# EAGLE design untitled (EAGLE 9.6.2)
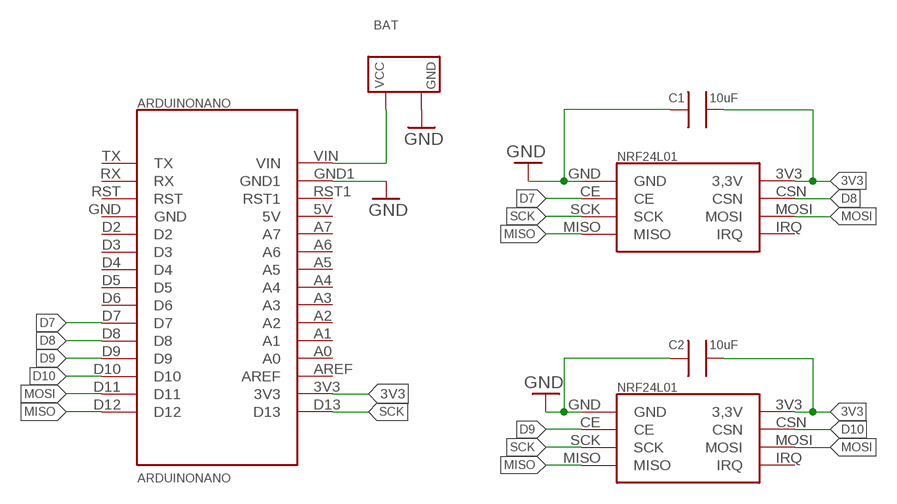
[diagram p0: schematic, sheet 1]

## Parts
ARDUINONANO  ARDUINONANO  [ARDUINONANO]
BAT1  BATBAT  [BAT]
C1  NRF24L01  [NRF24L01]
C2  NRF24L01  [NRF24L01]
U$3  C  [C]
U$4  C  [C]

## Nets
3V3: ARDUINONANO.3V3 C1.3V3(3,3V) C2.3V3(3,3V) U$3.+ U$4.+
D7: ARDUINONANO.D7 C2.CE
D8: ARDUINONANO.D8 C2.CSN
D9: ARDUINONANO.D9 C1.CE
D10: ARDUINONANO.D10 C1.CSN
GND: ARDUINONANO.GND1 BAT1.GND C1.GND C2.GND U$3.- U$4.-
MISO: ARDUINONANO.D12 C1.MISO C2.MISO
MOSI: ARDUINONANO.D11 C1.MOSI C2.MOSI
N$4: ARDUINONANO.VIN BAT1.VCC
SCK: ARDUINONANO.D13 C1.SCK C2.SCK
Unconnected: ARDUINONANO.5V ARDUINONANO.A0 ARDUINONANO.A1 ARDUINONANO.A2 ARDUINONANO.A3 ARDUINONANO.A4 ARDUINONANO.A5 ARDUINONANO.A6 ARDUINONANO.A7 ARDUINONANO.AREF ARDUINONANO.D2 ARDUINONANO.D3 ARDUINONANO.D4 ARDUINONANO.D5 ARDUINONANO.D6 ARDUINONANO.GND ARDUINONANO.RST ARDUINONANO.RST1 ARDUINONANO.RX ARDUINONANO.TX C1.IRQ C2.IRQ

## Notes on the sheet
- BAT
- C1 | 10uF
- C2 | 10uF

## Library data of the parts
ARDUINONANO = lib prueba cnc:ARDUINONANO
BAT1 = Libreria banana leaf_V2:BAT
C1 C2 = Libreria banana leaf_V2:NRF24L01
U$3 U$4 = lib prueba cnc:C

## Board
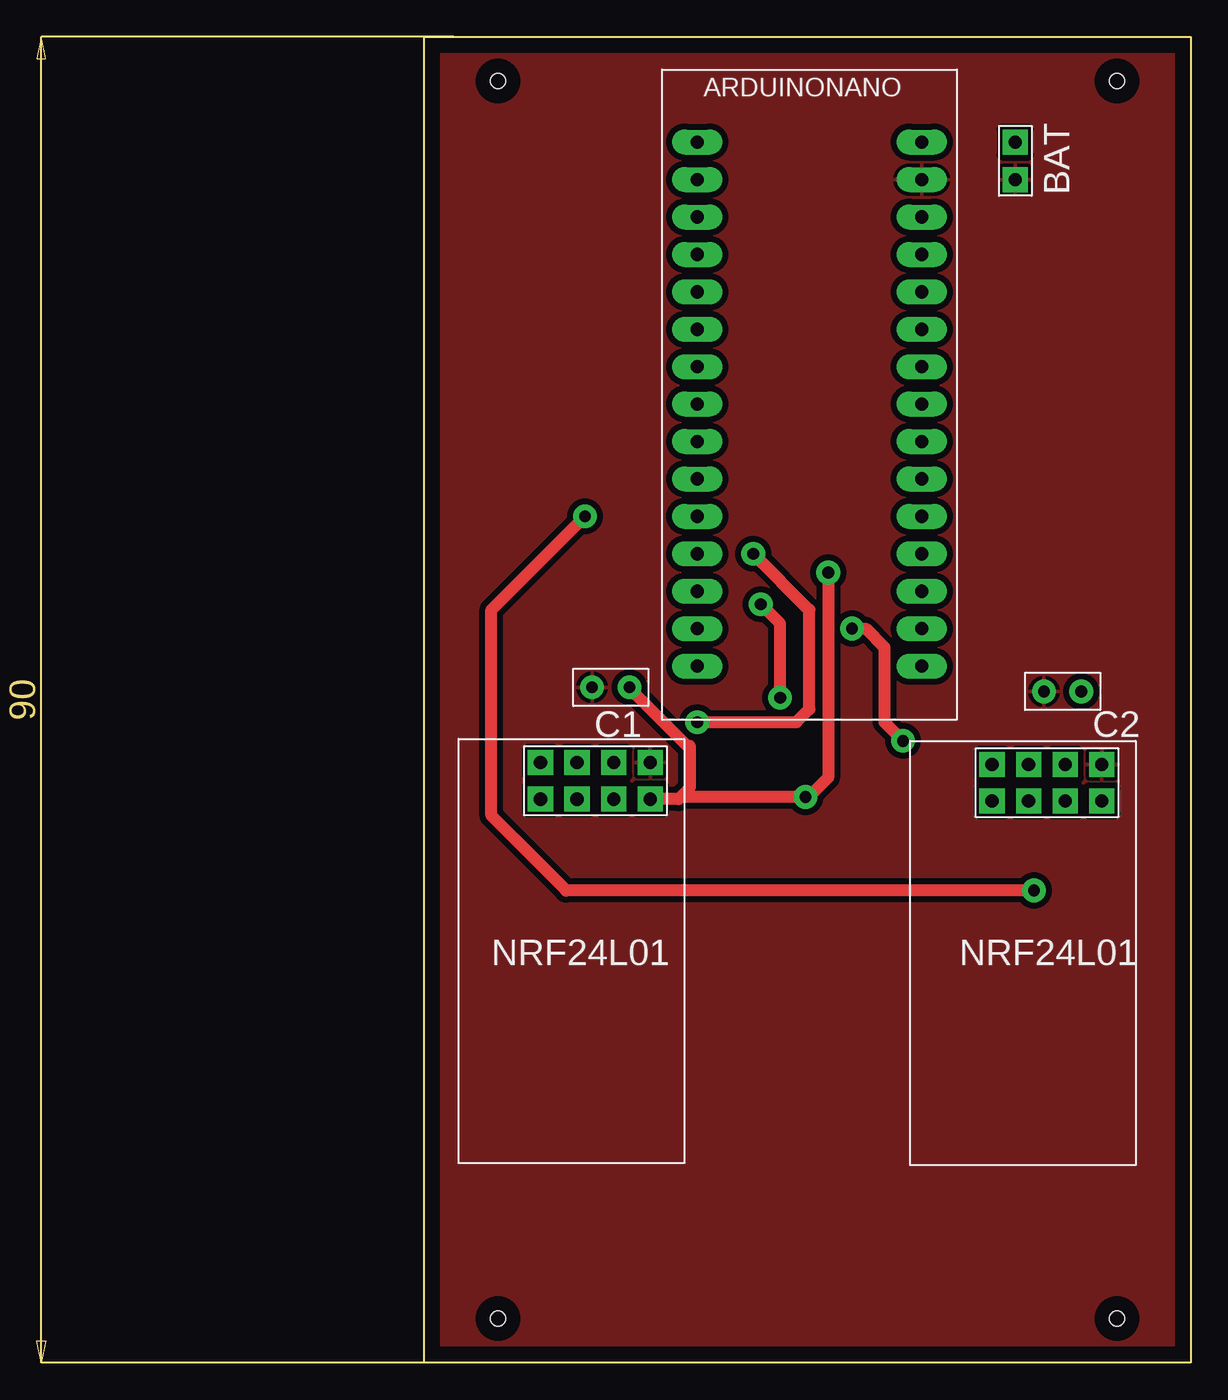
[diagram p1: board, top side]
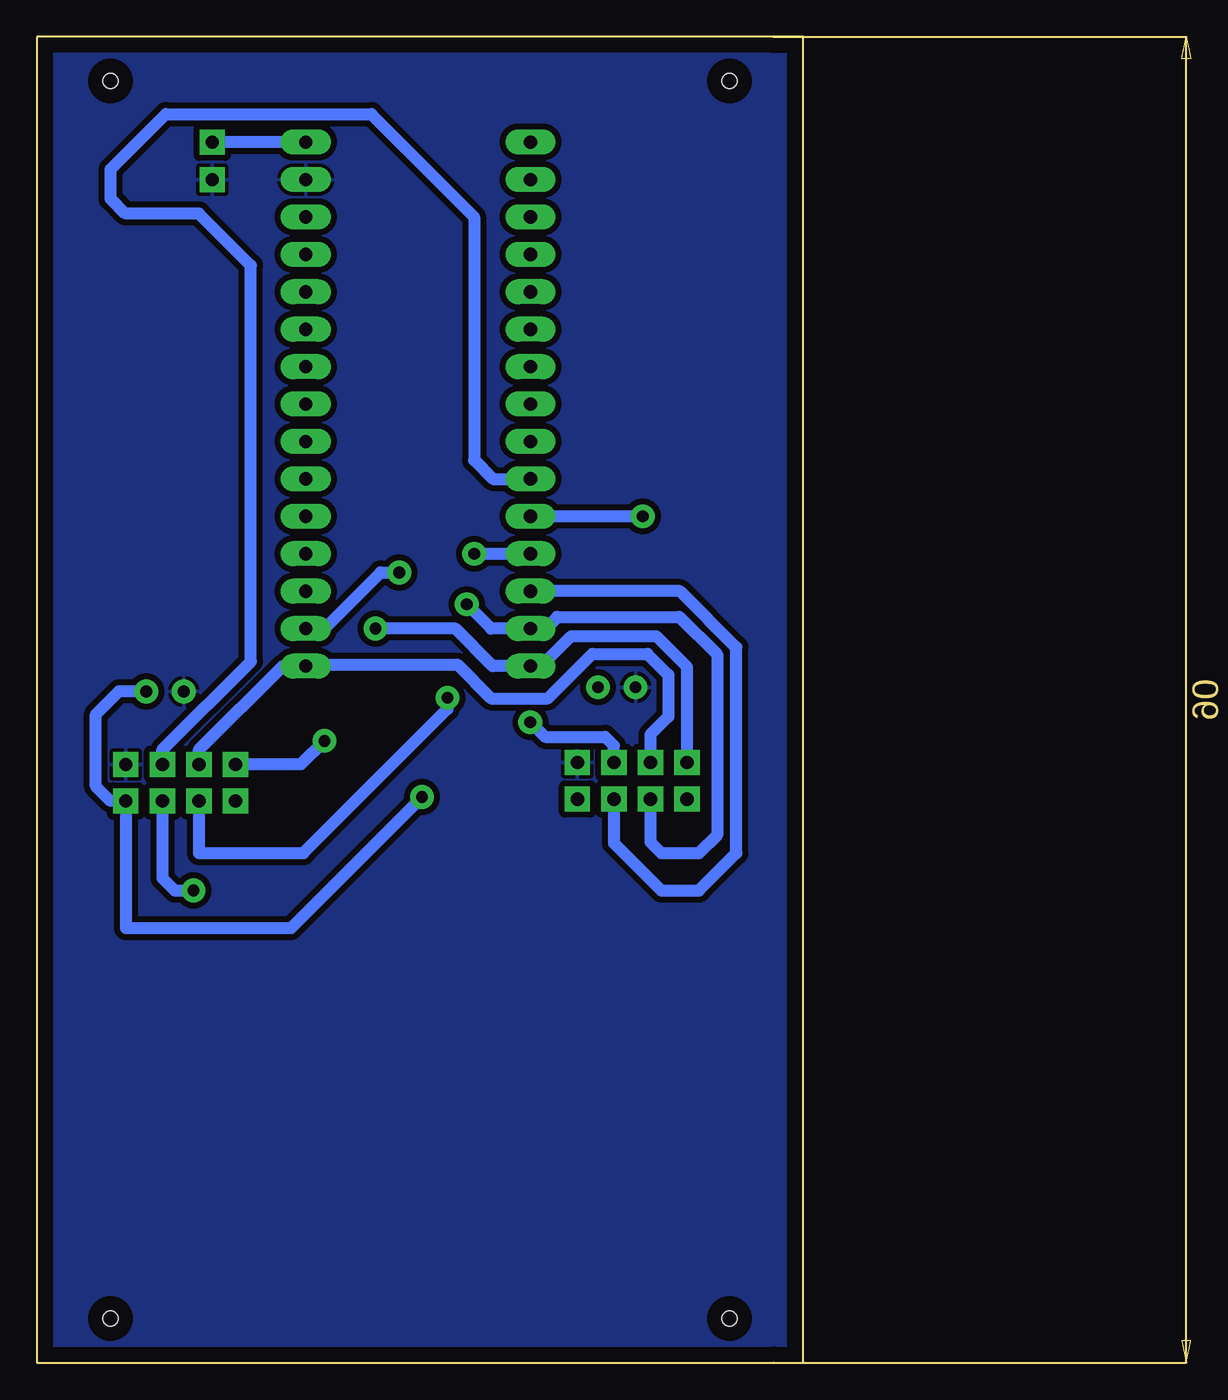
[diagram p2: board, bottom side, seen from below]

Size 52 x 90 mm. Coordinates in mm from the lower left corner, seen from the top.
Outline: 0,0 0,90 52,90 52,0 0,0
Copper layers (1*16): Top 0.035mm / dielectric 1.5mm / Bottom 0.035mm
Design rules "default *": minimum track width 0.8mm, minimum drill 0.8mm, track to track 16mil, track to pad 16mil, pad to pad 16mil, via to via 16mil, smd to smd 16mil, copper to edge 40mil, drill to drill 6mil, minimum pad ring 16mil, minimum via ring 16mil, stop-mask expansion 4mil, vias tented up to drill 0mil, thermal gap 10mil
Holes 1 mm at 5,87 47,87 5,3 47,3

### Footprints (pad centres in the part's own frame; a part is rotated, then mirrored left to right if it is on the bottom)
ARDUINONANO = drill 0.9 pad 1.27 long: 3V3 7.62,-15.24; 5V 7.62,10.16; A0 7.62,-10.16; A1 7.62,-7.62; A2 7.62,-5.08; A3 7.62,-2.54; A4 7.62,0; A5 7.62,2.54; A6 7.62,5.08; A7 7.62,7.62; AREF 7.62,-12.7; D2 -7.62,7.62; D3 -7.62,5.08; D4 -7.62,2.54; D5 -7.62,0; D6 -7.62,-2.54; D7 -7.62,-5.08; D8 -7.62,-7.62; D9 -7.62,-10.16; D10 -7.62,-12.7; D11 -7.62,-15.24; D12 -7.62,-17.78; D13 7.62,-17.78; GND -7.62,10.16; GND1 7.62,15.24; RST -7.62,12.7; RST1 7.62,12.7; RX -7.62,15.24; TX -7.62,17.78; VIN 7.62,17.78
BAT = drill 0.9 square: GND 0,-1.27; VCC 0,1.27
NRF24L01 = drill 0.9 square: 3V3 4.08,-2.3; CE 1.6,-4.78; CSN 4.08,-4.78; GND 1.6,-2.3; IRQ 4.08,-9.74; MISO 1.6,-9.74; MOSI 4.08,-7.26; SCK 1.6,-7.26
C = drill 0.8: + 0,0; - -2.54,0

### Placement (x,y rotation side)
ARDUINONANO  26.13,65.07 0 top
BAT1  40.1,81.58 0 top
C1  17.62,42.34 270 top
C2  48.26,42.21 270 top
U$3  13.91,45.84 0 top
U$4  44.58,45.56 0 top

### Tracks (layer width: path | path; a pad name or v marks a point on that pad's centre or on a via)
3V3  (via drill 0.8)
  Top 0.8: v27.4,53.64 27.4,39.72 26.08,38.4 v25.86,38.4 17.4,38.4 | U$3.+ 13.91,45.79 17.84,41.87 18,41.87 18,39 17.4,38.4 | C1.3V3 17.26,38.26 17.4,38.4
  Bottom 0.8: 25.57,38.11 v25.86,38.4 34.75,29.51 45.96,29.51 C2.3V3 47,38.13 48,39.13 48,44 46.44,45.56 U$4.+ | ARDUINONANO.3V3 32.48,49.83 28.67,53.64 v27.4,53.64
D7
  Bottom 0.8: C2.CE 43.48,41.61 37.48,47.61 37.48,74.48 41,78 46,78 47,79 47,81 43.24,84.75 29.3,84.75 22.32,77.77 22.32,61.26 21.05,59.99 ARDUINONANO.D7
D8  (via drill 0.8)
  Top 0.8: v41.37,32.05 9.62,32.05 4.54,37.13 4.54,51.1 v10.89,57.45
  Bottom 0.8: C2.CSN 43.48,32.89 42.64,32.05 v41.37,32.05 | v10.89,57.45 ARDUINONANO.D8
D9  (via drill 0.8)
  Top 0.8: v22.32,54.91 26.13,51.1 26.13,44.37 25.24,43.48 v18.51,43.48
  Bottom 0.8: v22.32,54.91 ARDUINONANO.D9 | C1.CE 12.84,41.89 13.43,42.48 17.51,42.48 v18.51,43.48
D10
  Bottom 0.8: C1.CSN 12.84,35.27 9.62,32.05 7.08,32.05 4.54,34.59 4.54,48.56 8.35,52.37 ARDUINONANO.D10
GND
  pour Bottom: 0,0 0,90 52,90 52,0
  pour Top: 0,0 0,90 52,90 52,0
MISO  (via drill 0.8)
  Top 0.8: v29.01,49.83 29.94,49.83 31.21,48.56 31.21,43.48 v32.48,42.21
  Bottom 0.8: C1.MISO 7.88,47.22 9.98,49.32 15.73,49.32 17.38,47.67 18.13,47.67 ARDUINONANO.D12 21.05,47.29 23.59,49.83 v29.01,49.83 | C2.MISO 34.08,40.61 v32.48,42.21
MOSI  (via drill 0.8)
  Top 0.8: v24.14,45.13 24.14,50.17 v22.83,51.48
  Bottom 0.8: C1.MOSI 10.36,35.33 9.62,34.59 7.08,34.59 5.81,35.86 5.81,48.02 8.41,50.62 16.7,50.62 17.49,49.83 ARDUINONANO.D11 21.18,49.83 v22.83,51.48 | C2.MOSI 41,34.59 33.91,34.59 24.14,44.37 v24.14,45.13
N$4
  Bottom 0.8: ARDUINONANO.VIN BAT1.VCC
SCK
  Bottom 0.8: C2.SCK 41,41.61 35.32,47.29 ARDUINONANO.D13 33.66,47.38 23.47,47.38 21.18,45.09 17.32,45.09 14.3,48.11 10.57,48.11 9.15,46.69 9.15,43.85 10.36,42.64 C1.SCK

### Text on the board
tNames: BAT | NRF24L01 | NRF24L01